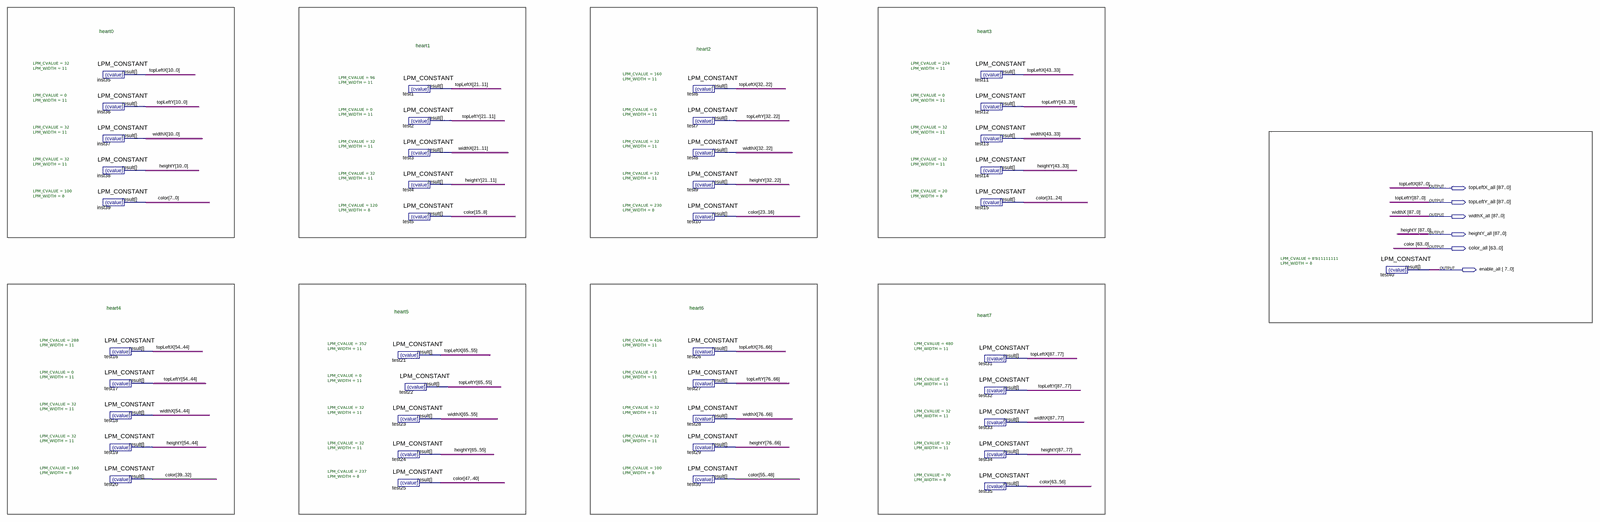
[diagram p0: schematic sheet, whole]
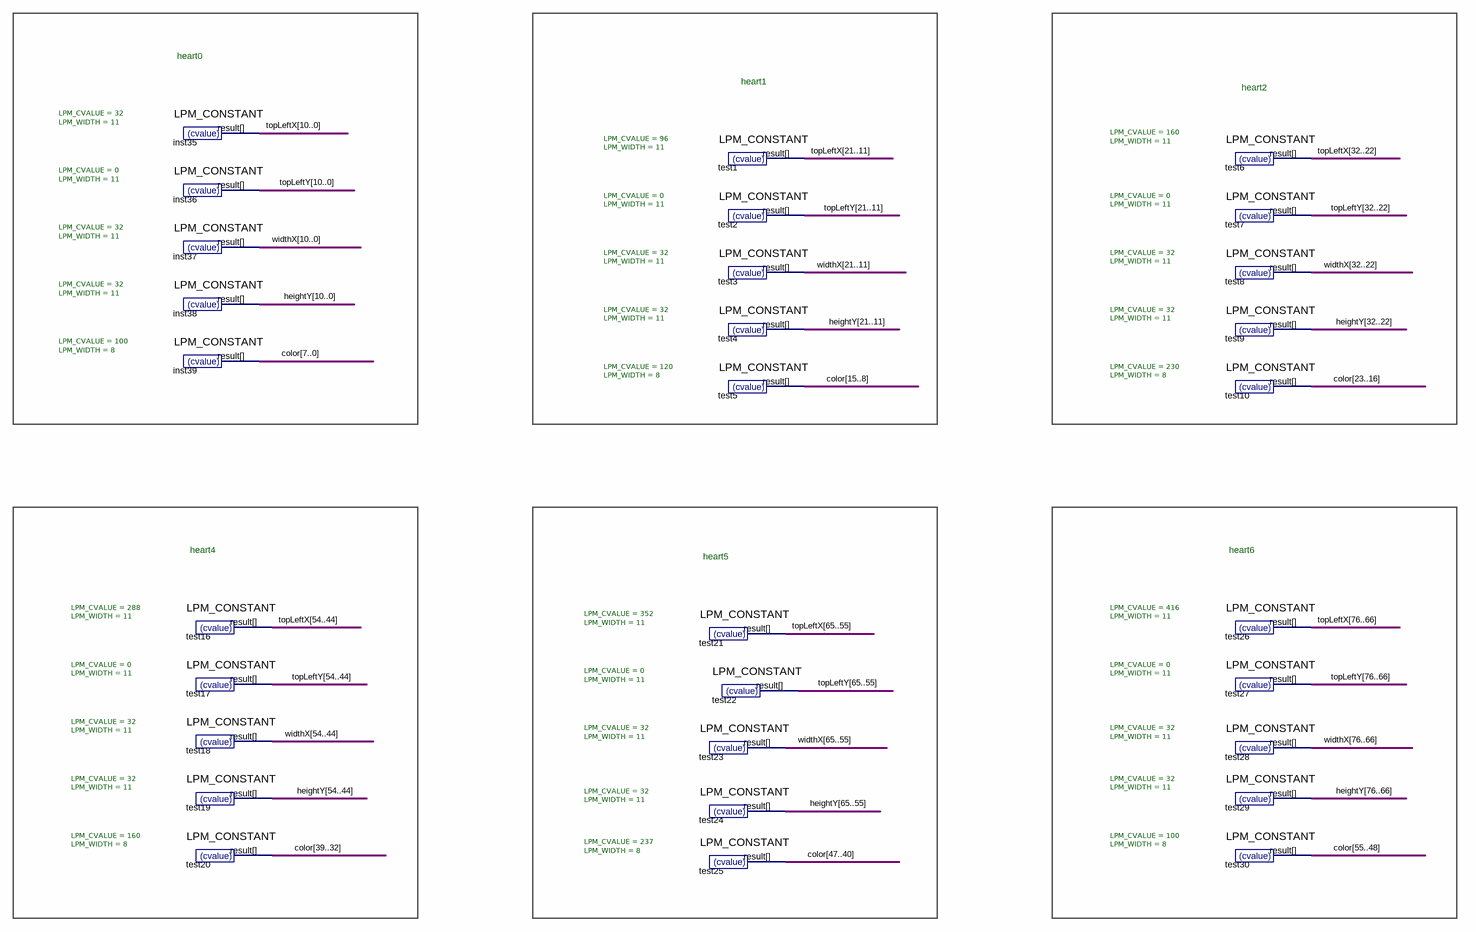
[diagram p1: schematic sheet, left part]
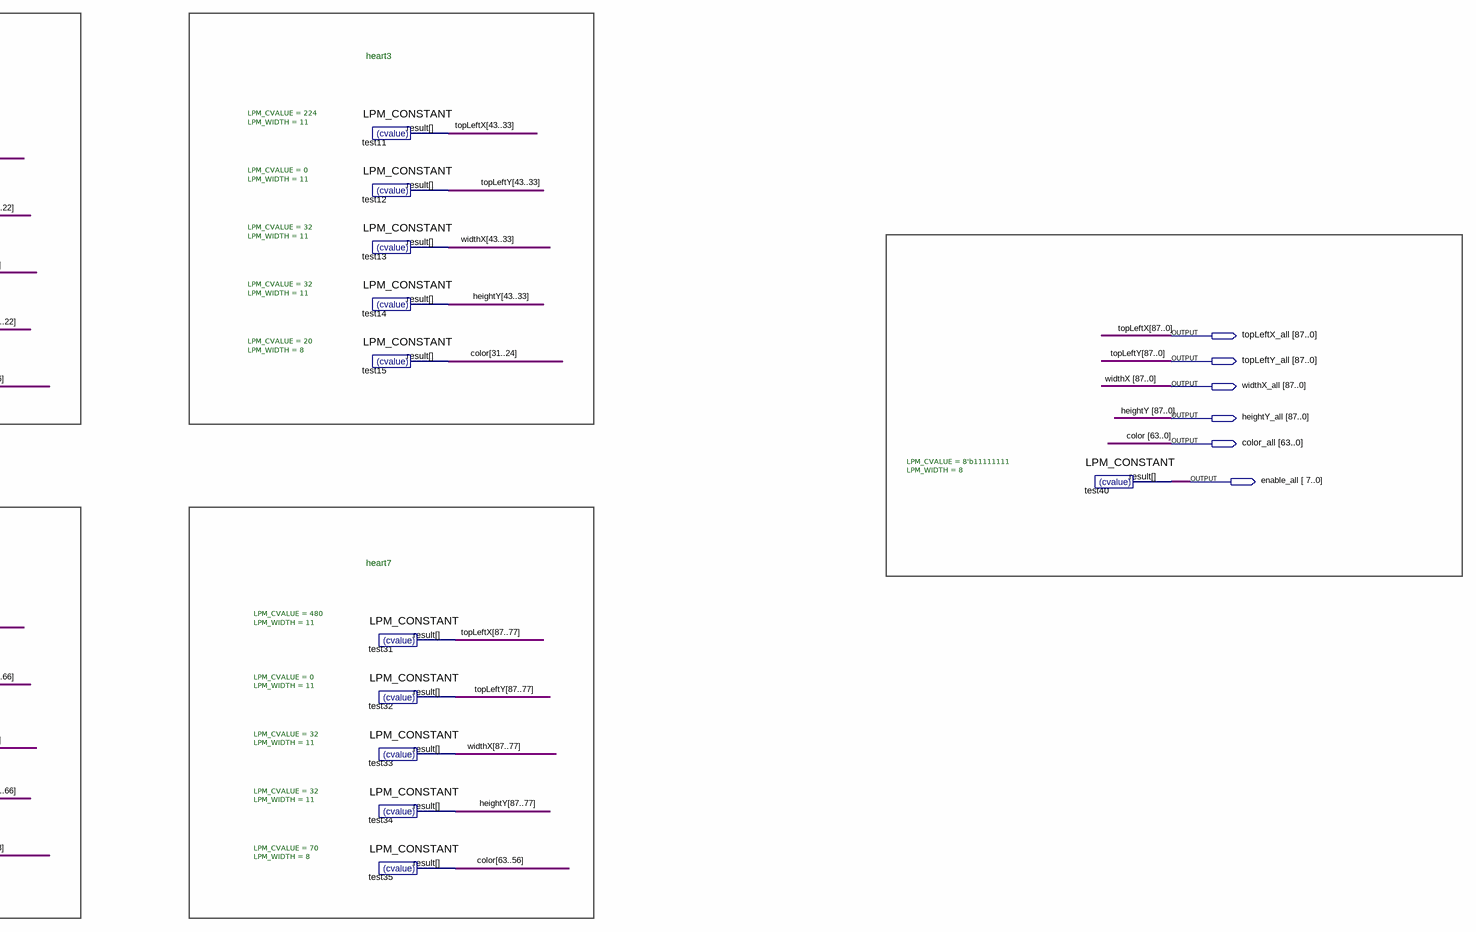
[diagram p2: schematic sheet, right part]
// Quartus schematic heartValues.bdf as structural Verilog: 41 symbols, 6 pins
module heartValues (
  output [87:0] topLeftX_all,
  output [87:0] topLeftY_all,
  output [87:0] widthX_all,
  output [87:0] heightY_all,
  output [63:0] color_all,
  output [7:0] enable_all
);

  LPM_CONSTANT #(.LPM_CVALUE(32), .LPM_WIDTH(11)) inst35 (.result(topLeftX_all[10:0]));
  LPM_CONSTANT #(.LPM_CVALUE(0), .LPM_WIDTH(11)) inst36 (.result(topLeftY_all[10:0]));
  LPM_CONSTANT #(.LPM_CVALUE(32), .LPM_WIDTH(11)) inst37 (.result(widthX_all[10:0]));
  LPM_CONSTANT #(.LPM_CVALUE(32), .LPM_WIDTH(11)) inst38 (.result(heightY_all[10:0]));
  LPM_CONSTANT #(.LPM_CVALUE(100), .LPM_WIDTH(8)) inst39 (.result(color_all[7:0]));
  LPM_CONSTANT #(.LPM_CVALUE(288), .LPM_WIDTH(11)) test16 (.result(topLeftX_all[54:44]));
  LPM_CONSTANT #(.LPM_CVALUE(0), .LPM_WIDTH(11)) test17 (.result(topLeftY_all[54:44]));
  LPM_CONSTANT #(.LPM_CVALUE(32), .LPM_WIDTH(11)) test18 (.result(widthX_all[54:44]));
  LPM_CONSTANT #(.LPM_CVALUE(32), .LPM_WIDTH(11)) test19 (.result(heightY_all[54:44]));
  LPM_CONSTANT #(.LPM_CVALUE(160), .LPM_WIDTH(8)) test20 (.result(color_all[39:32]));
  LPM_CONSTANT #(.LPM_CVALUE(96), .LPM_WIDTH(11)) test1 (.result(topLeftX_all[21:11]));
  LPM_CONSTANT #(.LPM_CVALUE(0), .LPM_WIDTH(11)) test2 (.result(topLeftY_all[21:11]));
  LPM_CONSTANT #(.LPM_CVALUE(32), .LPM_WIDTH(11)) test3 (.result(widthX_all[21:11]));
  LPM_CONSTANT #(.LPM_CVALUE(32), .LPM_WIDTH(11)) test4 (.result(heightY_all[21:11]));
  LPM_CONSTANT #(.LPM_CVALUE(120), .LPM_WIDTH(8)) test5 (.result(color_all[15:8]));
  LPM_CONSTANT #(.LPM_CVALUE(352), .LPM_WIDTH(11)) test21 (.result(topLeftX_all[65:55]));
  LPM_CONSTANT #(.LPM_CVALUE(0), .LPM_WIDTH(11)) test22 (.result(topLeftY_all[65:55]));
  LPM_CONSTANT #(.LPM_CVALUE(32), .LPM_WIDTH(11)) test23 (.result(widthX_all[65:55]));
  LPM_CONSTANT #(.LPM_CVALUE(32), .LPM_WIDTH(11)) test24 (.result(heightY_all[65:55]));
  LPM_CONSTANT #(.LPM_CVALUE(237), .LPM_WIDTH(8)) test25 (.result(color_all[47:40]));
  LPM_CONSTANT #(.LPM_CVALUE(160), .LPM_WIDTH(11)) test6 (.result(topLeftX_all[32:22]));
  LPM_CONSTANT #(.LPM_CVALUE(0), .LPM_WIDTH(11)) test7 (.result(topLeftY_all[32:22]));
  LPM_CONSTANT #(.LPM_CVALUE(32), .LPM_WIDTH(11)) test8 (.result(widthX_all[32:22]));
  LPM_CONSTANT #(.LPM_CVALUE(32), .LPM_WIDTH(11)) test9 (.result(heightY_all[32:22]));
  LPM_CONSTANT #(.LPM_CVALUE(230), .LPM_WIDTH(8)) test10 (.result(color_all[23:16]));
  LPM_CONSTANT #(.LPM_CVALUE(416), .LPM_WIDTH(11)) test26 (.result(topLeftX_all[76:66]));
  LPM_CONSTANT #(.LPM_CVALUE(0), .LPM_WIDTH(11)) test27 (.result(topLeftY_all[76:66]));
  LPM_CONSTANT #(.LPM_CVALUE(32), .LPM_WIDTH(11)) test28 (.result(widthX_all[76:66]));
  LPM_CONSTANT #(.LPM_CVALUE(32), .LPM_WIDTH(11)) test29 (.result(heightY_all[76:66]));
  LPM_CONSTANT #(.LPM_CVALUE(100), .LPM_WIDTH(8)) test30 (.result(color_all[55:48]));
  LPM_CONSTANT #(.LPM_CVALUE(224), .LPM_WIDTH(11)) test11 (.result(topLeftX_all[43:33]));
  LPM_CONSTANT #(.LPM_CVALUE(0), .LPM_WIDTH(11)) test12 (.result(topLeftY_all[43:33]));
  LPM_CONSTANT #(.LPM_CVALUE(32), .LPM_WIDTH(11)) test13 (.result(widthX_all[43:33]));
  LPM_CONSTANT #(.LPM_CVALUE(32), .LPM_WIDTH(11)) test14 (.result(heightY_all[43:33]));
  LPM_CONSTANT #(.LPM_CVALUE(20), .LPM_WIDTH(8)) test15 (.result(color_all[31:24]));
  LPM_CONSTANT #(.LPM_CVALUE(480), .LPM_WIDTH(11)) test31 (.result(topLeftX_all[87:77]));
  LPM_CONSTANT #(.LPM_CVALUE(0), .LPM_WIDTH(11)) test32 (.result(topLeftY_all[87:77]));
  LPM_CONSTANT #(.LPM_CVALUE(32), .LPM_WIDTH(11)) test33 (.result(widthX_all[87:77]));
  LPM_CONSTANT #(.LPM_CVALUE(32), .LPM_WIDTH(11)) test34 (.result(heightY_all[87:77]));
  LPM_CONSTANT #(.LPM_CVALUE(70), .LPM_WIDTH(8)) test35 (.result(color_all[63:56]));
  LPM_CONSTANT #(.LPM_CVALUE(8'b11111111), .LPM_WIDTH(8)) test40 (.result(enable_all));

  // Other names for the same wires on the sheet: color[63:0] = color_all; heightY[87:0] = heightY_all;
  //   topLeftX[87:0] = topLeftX_all; topLeftY[87:0] = topLeftY_all; widthX[87:0] = widthX_all

  // Notes on the sheet:
  //   heart0
  //   heart3
  //   heart1
  //   heart2
  //   heart4
  //   heart6
  //   heart5
  //   heart7
endmodule
